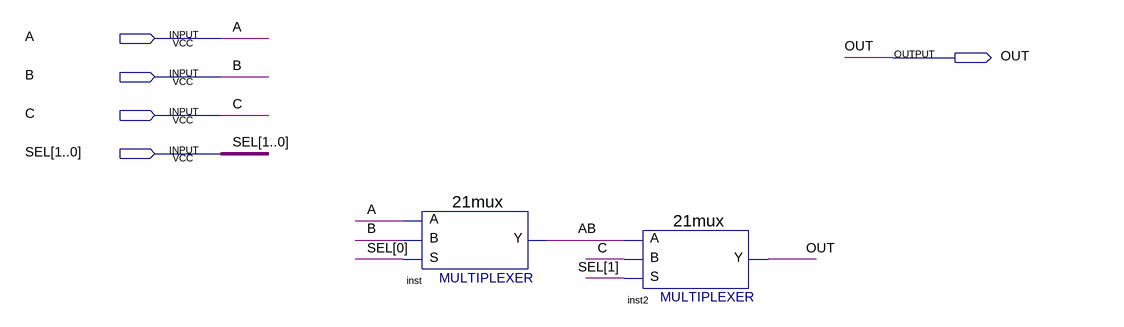
[diagram p0: schematic sheet]
// Quartus schematic mux3x1.bdf as structural Verilog: 2 symbols, 5 pins
module mux3x1 (
  input  A,
  input  B,
  input  C,
  input  [1:0] SEL,
  output OUT
);

  wire AB;

  \21mux  inst (.S(SEL[0]), .B(B), .A(A), .Y(AB));
  \21mux  inst2 (.S(SEL[1]), .B(C), .A(AB), .Y(OUT));
endmodule
